# Altium schematic sheet 转接板.SchDoc
size A3; SheetNumber: 1; SheetTotal: 1
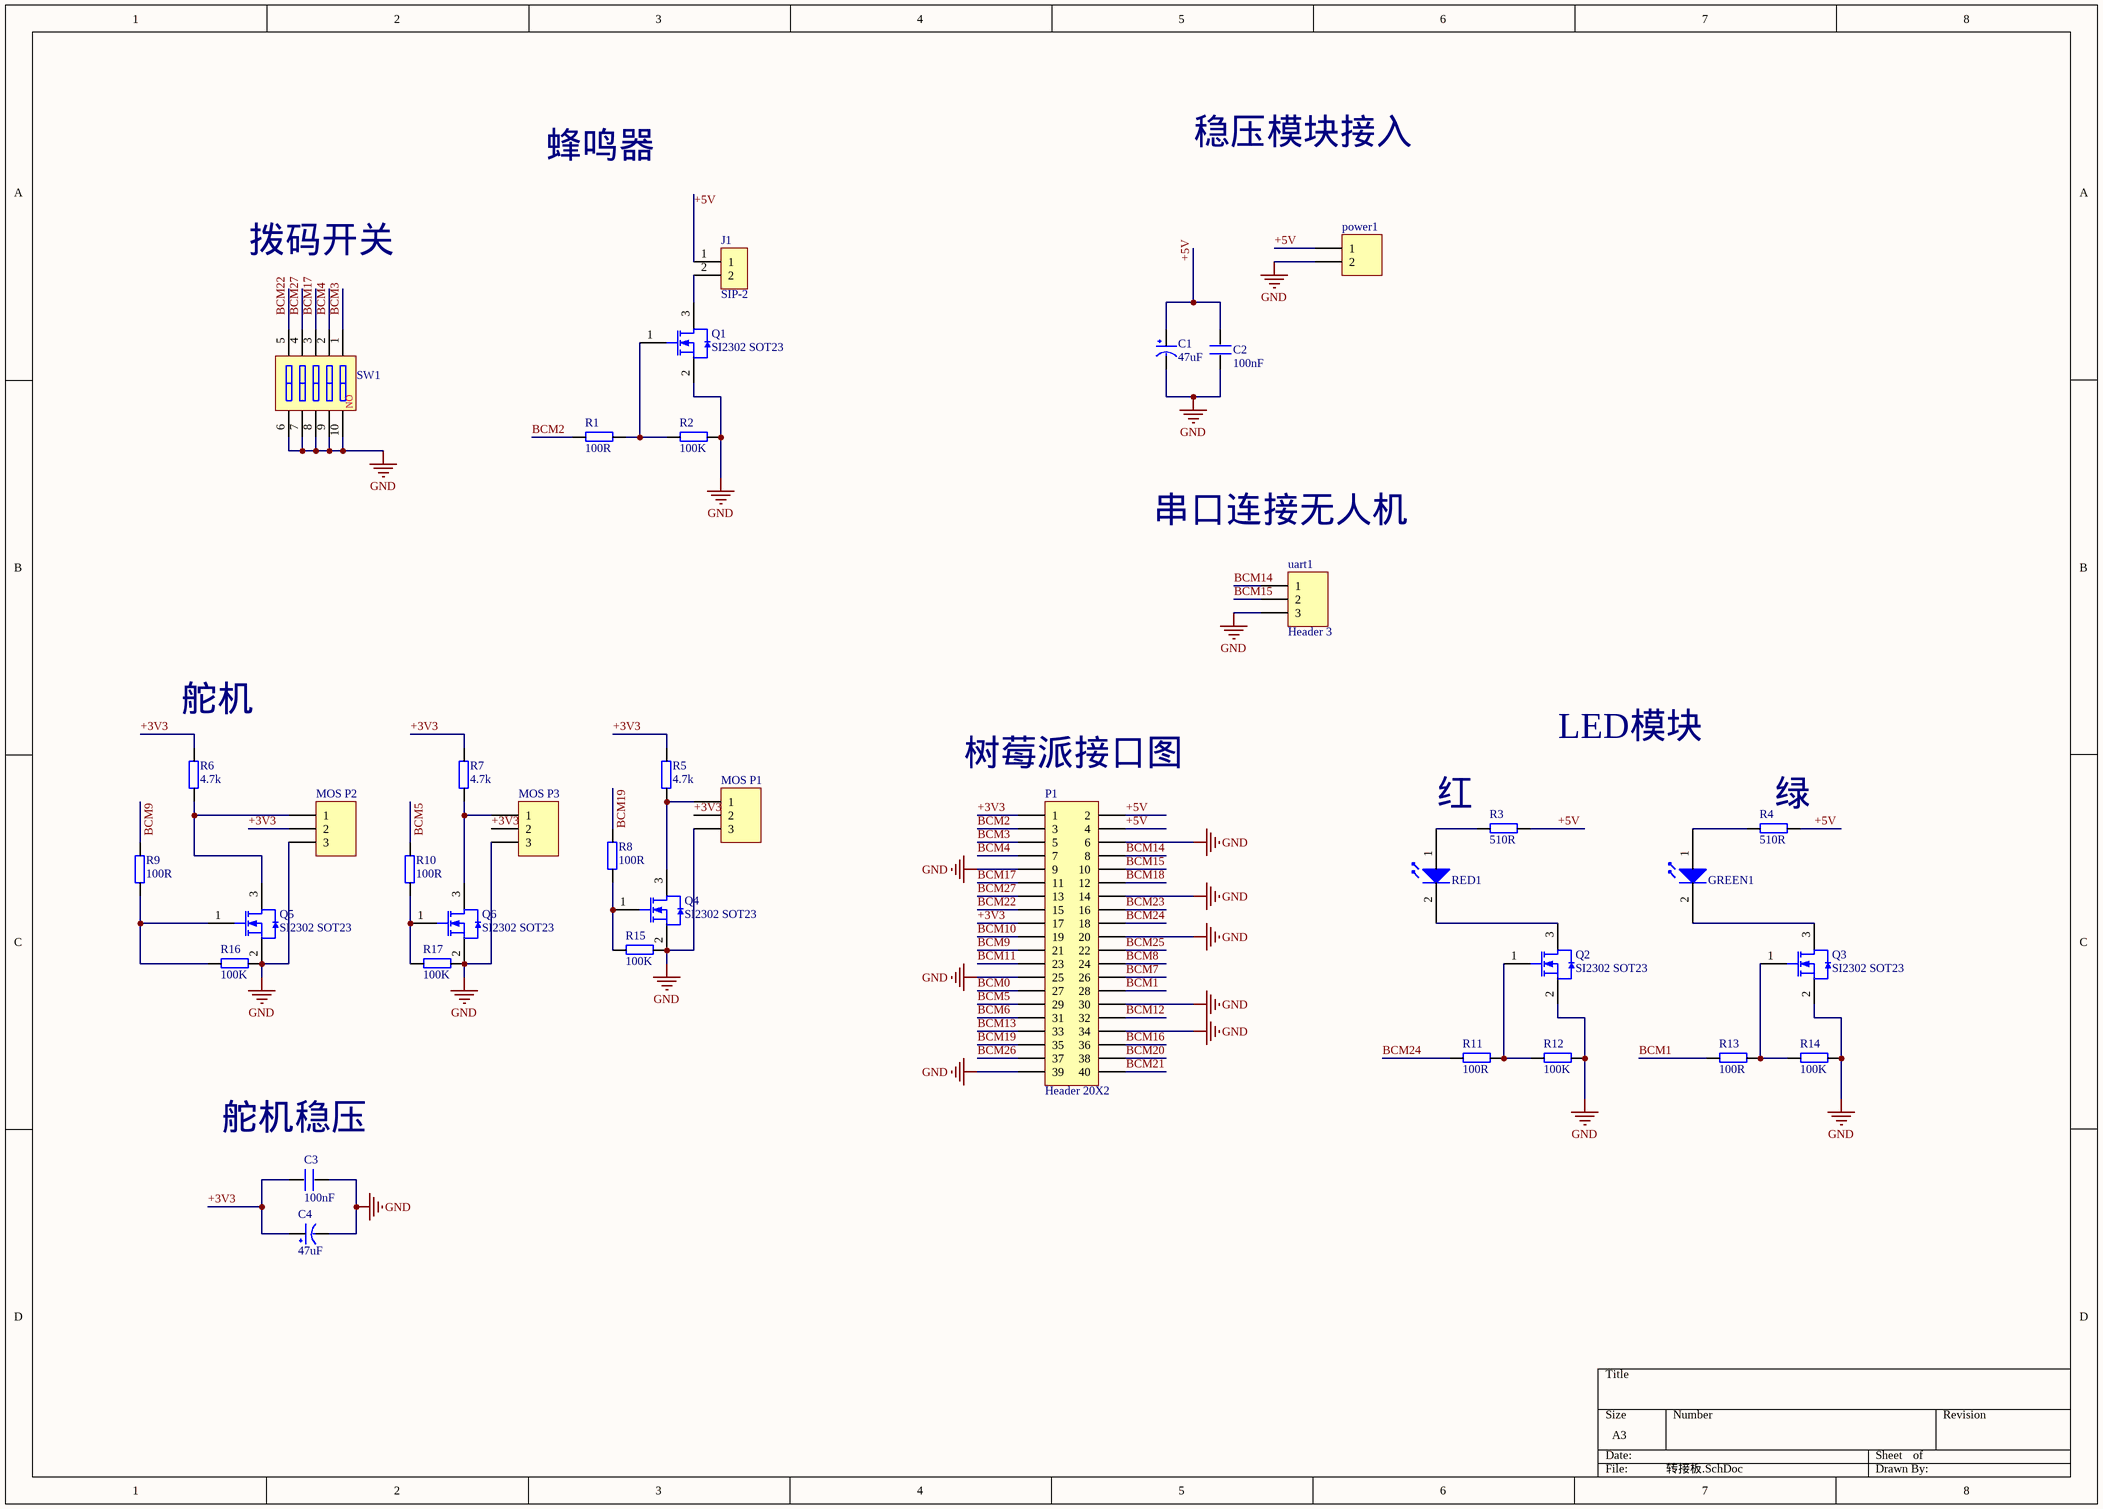
[diagram p0: 转接板.SchDoc]

## Parts
C1  47uF  [3216]
C2  100nF  [0603P]
C3  100nF  [0603P]
C4  47uF  [3216]
GREEN1  LED?  [LED 5MM-G]  (value not drawn)
J1  SIP-2  [5.08接线端子2P]
MOS_P1  Header 3  [HDR1X3]  (value not drawn)
MOS_P2  Header 3  [HDR1X3]  (value not drawn)
MOS_P3  Header 3  [HDR1X3]  (value not drawn)
P1  Header 20X2  [HDR2X20]
power1  Battery  [HDR1X2]  (value not drawn)
Q1  SI2302 SOT23  [SOT-23]
Q2  SI2302 SOT23  [SOT-23]
Q3  SI2302 SOT23  [SOT-23]
Q4  SI2302 SOT23  [SOT-23]
Q5  SI2302 SOT23  [SOT-23]
Q6  SI2302 SOT23  [SOT-23]
R1  100R  [0603P]
R2  100K  [0603P]
R3  510R  [0603P]
R4  510R  [0603P]
R5  4.7k  [0603P]
R6  4.7k  [0603P]
R7  4.7k  [0603P]
R8  100R  [0603P]
R9  100R  [0603P]
R10  100R  [0603P]
R11  100R  [0603P]
R12  100K  [0603P]
R13  100R  [0603P]
R14  100K  [0603P]
R15  100K  [0603P]
R16  100K  [0603P]
R17  100K  [0603P]
RED1  LED?  [LED 5MM-R]  (value not drawn)
SW1  5P  [拨码开关DIP-5P_G]  (value not drawn)
uart1  Header 3  [GH1.25-LS-3P]

## Nets
GND: C1.2(GND) C2.1 C3.1 C4.2(GND) MOS_P1.3 MOS_P2.3 MOS_P3.3 P1.6 P1.9 P1.14 P1.20 P1.25 P1.30 P1.34 P1.39 power1.2 Q1.2(S) Q2.2(S) Q3.2(S) Q4.2(S) Q5.2(S) Q6.2(S) R2.1 R12.1 R14.1 R15.1 R16.1 R17.1 SW1.6 SW1.7 SW1.8 SW1.9 SW1.10 uart1.3
+3V3: C3.2 C4.1(VCC) MOS_P1.2 MOS_P2.2 MOS_P3.2 P1.1 P1.17 R5.1 R6.1 R7.1
+5V: C1.1(VCC) C2.2 J1.1 P1.2 P1.4 power1.1 R3.1 R4.1
BCM0: P1.27
BCM1: P1.28 R13.2
BCM2: P1.3 R1.2
BCM3: P1.5 SW1.1
BCM4: P1.7 SW1.2
BCM5: P1.29 R10.1
BCM6: P1.31
BCM7: P1.26
BCM8: P1.24
BCM9: P1.21 R9.1
BCM10: P1.19
BCM11: P1.23
BCM12: P1.32
BCM13: P1.33
BCM14: P1.8 uart1.1
BCM15: P1.10 uart1.2
BCM16: P1.36
BCM17: P1.11 SW1.3
BCM18: P1.12
BCM19: P1.35 R8.1
BCM20: P1.38
BCM21: P1.40
BCM22: P1.15 SW1.5
BCM23: P1.16
BCM24: P1.18 R11.2
BCM25: P1.22
BCM26: P1.37
BCM27: P1.13 SW1.4
NetGREEN1_1: GREEN1.1 R4.2
NetGREEN1_2: GREEN1.2 Q3.3(D)
NetJ1_2: J1.2 Q1.3(D)
NetMOS_P1_1: MOS_P1.1 Q4.3(D) R5.2
NetMOS_P2_1: MOS_P2.1 Q5.3(D) R6.2
NetMOS_P3_1: MOS_P3.1 Q6.3(D) R7.2
NetQ1_1: Q1.1(G) R1.1 R2.2
NetQ2_1: Q2.1(G) R11.1 R12.2
NetQ2_3: Q2.3(D) RED1.2
NetQ3_1: Q3.1(G) R13.1 R14.2
NetQ4_1: Q4.1(G) R8.2 R15.2
NetQ5_1: Q5.1(G) R9.2 R16.2
NetQ6_1: Q6.1(G) R10.2 R17.2
NetR3_2: R3.2 RED1.1

## Notes on the sheet
- 蜂鸣器
- 稳压模块接入
- 拨码开关
- 串口连接无人机
- (near R6) 舵机
- (near P1) 树莓派接口图
- LED模块
- 红
- (near R4) 绿
- (near C3) 舵机稳压
- (in symbol 拨码开关5P) NO

## Library data of the parts
C1 C4 = CAP
C2 C3 = C
GREEN1 RED1 = LED
MOS_P1-MOS_P3 uart1 = Header 3: Header, 3-Pin; LatestRevisionDate: 17-Jul-2002; LatestRevisionNote: Re-released for DXP Platform.; Publisher: Altium Limited
P1 = Header 20X2: Header, 20-Pin, Dual row; LatestRevisionDate: 17-Jul-2002; LatestRevisionNote: Re-released for DXP Platform.; Publisher: Altium Limited
power1 = Header 2: Header, 2-Pin; LatestRevisionDate: 17-Jul-2002; LatestRevisionNote: Re-released for DXP Platform.; Publisher: Altium Limited
Q1-Q6 = NMOS
R1-R17 = R
SW1 = 拨码开关5P